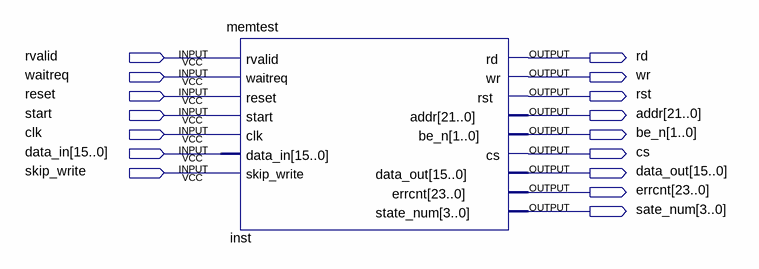
[diagram p0: schematic sheet]
// Quartus schematic memtest_simulation.bdf as structural Verilog: 1 symbols, 16 pins
module memtest_simulation (
  input  rvalid,
  input  waitreq,
  input  reset,
  input  start,
  input  clk,
  input  [15:0] data_in,
  input  skip_write,
  output rd,
  output wr,
  output rst,
  output [21:0] addr,
  output [1:0] be_n,
  output cs,
  output [15:0] data_out,
  output [23:0] errcnt,
  output [3:0] sate_num
);

  memtest inst (
    .rvalid(rvalid), .waitreq(waitreq), .reset(reset), .start(start), .clk(clk), .data_in(data_in),
    .skip_write(skip_write), .rd(rd), .wr(wr), .rst(rst), .addr(addr), .be_n(be_n), .cs(cs),
    .data_out(data_out), .errcnt(errcnt), .state_num(sate_num));
endmodule
